# Altium project PCBCamera.PrjPcb
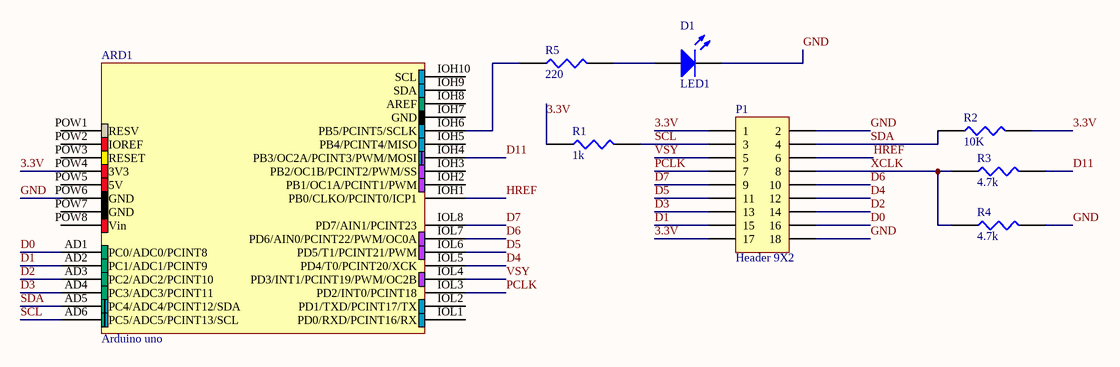
[diagram p0: Sheet1.SchDoc]
1 sheet, 8 parts. Net scope: global (net labels, ports and power ports of the same name join across sheets).
Board file: PCB1.PcbDoc

## Sheet Sheet1.SchDoc
size A

### Parts
ARD1  Arduino uno  [ARDUINO_UNO]
D1  LED1  [LED-1]
P1  Header 9X2  [HDR2X9]
R1  value 1k  [My_axial-0.4]  (hidden comment: 470R)
R2  value 10K  [My_axial-0.4]  (hidden comment: 470R)
R3  value 4.7k  [My_axial-0.4]  (hidden comment: 470R)
R4  value 4.7k  [My_axial-0.4]  (hidden comment: 470R)
R5  value 220  [My_axial-0.4]  (hidden comment: 470R)

### Nets
3.3V: ARD1.POW4(3V3) P1.1 P1.17 R1.1 R2.2
D0: ARD1.AD1(PC0/ADC0/PCINT8) P1.16
D1: ARD1.AD2(PC1/ADC1/PCINT9) P1.15
D2: ARD1.AD3(PC2/ADC2/PCINT10) P1.14
D3: ARD1.AD4(PC3/ADC3/PCINT11) P1.13
D4: ARD1.IOL5(PD4/T0/PCINT20/XCK) P1.12
D5: ARD1.IOL6(PD5/T1/PCINT21/PWM) P1.11
D6: ARD1.IOL7(PD6/AIN0/PCINT22/PWM/OC0A) P1.10
D7: ARD1.IOL8(PD7/AIN1/PCINT23) P1.9
D11: ARD1.IOH4(PB3/OC2A/PCINT3/PWM/MOSI) R3.2
GND: ARD1.POW6(GND) D1.2(K) P1.2 P1.18 R4.2
HREF: ARD1.IOH1(PB0/CLKO/PCINT0/ICP1) P1.6
PCLK: ARD1.IOL3(PD2/INT0/PCINT18) P1.7
SCL: ARD1.AD6(PC5/ADC5/PCINT13/SCL) P1.3 R1.2
SDA: ARD1.AD5(PC4/ADC4/PCINT12/SDA) P1.4 R2.1
VSY: ARD1.IOL4(PD3/INT1/PCINT19/PWM/OC2B) P1.5
XCLK: P1.8 R3.1 R4.1
NetARD1_IOH6: ARD1.IOH6(PB5/PCINT5/SCLK) R5.1
NetD1_1: D1.1(A) R5.2

Not connected (* = marked no-connect by the designer): ARD1 IOH2(PB1/OC1A/PCINT1/PWM) IOH3(PB2/OC1B/PCINT2/PWM/SS) IOH5(PB4/PCINT4/MISO) IOH7(GND) IOH8(AREF) IOH9(SDA) IOH10(SCL) IOL1(PD0/RXD/PCINT16/RX) IOL2(PD1/TXD/PCINT17/TX) POW1(RESV) POW2(IOREF) POW3(RESET) POW5(5V) POW7(GND) POW8(Vin)

### Library data of the parts
ARD1 = Arduino uno: Arduino UNO Connector
D1 = LED1: Typical RED GaAs LED; Published: 8-Jun-2000; LatestRevisionDate: 08-Jul-2005; LatestRevisionNote: Mech Layer 1 removed.; PackageReference: LED-1; Publisher: Altium Limited; PackageDescription: LED; 2 Leads
P1 = Header 9X2: Header, 9-Pin, Dual row; LatestRevisionDate: 17-Jul-2002; LatestRevisionNote: Re-released for DXP Platform.; Publisher: Altium Limited
R1-R5 = Res: resistor 1/4 wat